# Altium schematic sheet Connectors.SchDoc
size A4
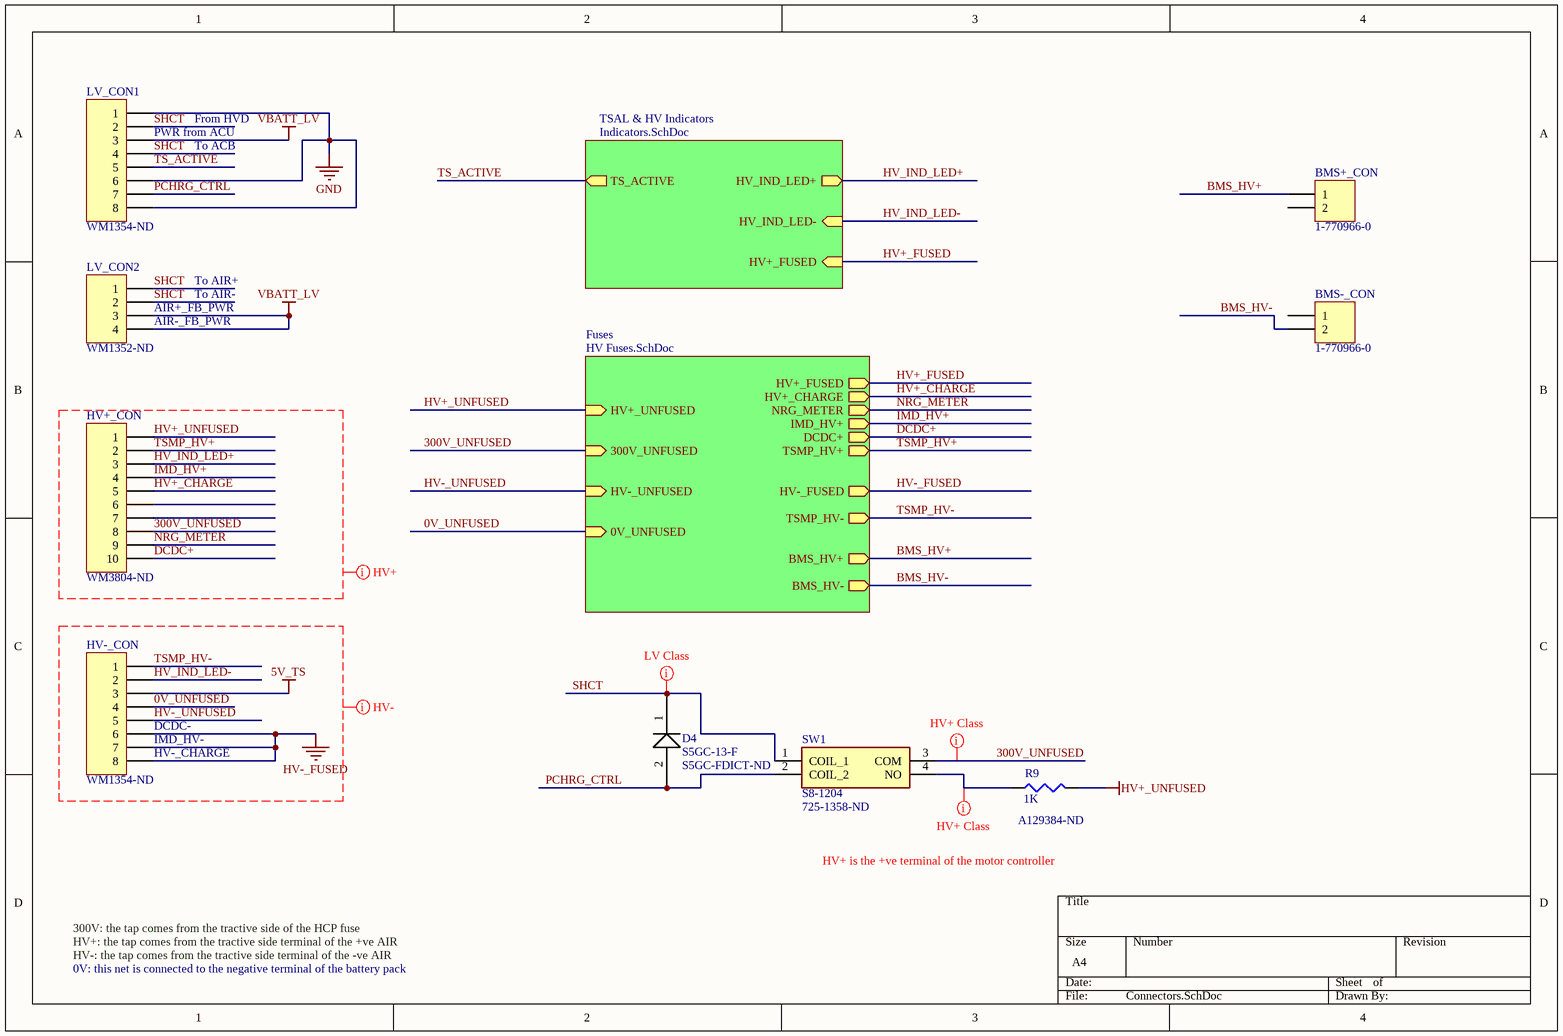
[diagram p0: Connectors.SchDoc]

## Parts
BMS+_CON  1-770966-0  [TE  1-770966-0 2POS CONN]
BMS-_CON  1-770966-0  [TE  1-770966-0 2POS CONN]
D4  S5GC-13-F  Supplier Part Number 1: S5GC-FDICT-ND  [DO-214AB]
HV+_CON  (no value)  [WM3804-ND]
HV-_CON  Supplier Part Number 1: WM1354-ND  [WM3846-ND]  (hidden comment: Header 8)
LV_CON1  Supplier Part Number 1: WM1354-ND  [WM3846-ND]  (hidden comment: Header 8)
LV_CON2  Supplier Part Number 1: WM1352-ND  [WM3801-ND]  (hidden comment: Header 4)
R9  1K  Supplier Part Number 1: A129384-ND  [AXIAL RESISTOR WW 14W]
SW1  S8-1204  Supplier Part Number 1: 725-1358-ND  [S80504VU]

## Sub-sheets
Fuses = HV Fuses.SchDoc: HV+_UNFUSED (in), 300V_UNFUSED (in), HV+_CHARGE (out), NRG_METER (out), IMD_HV+ (out), BMS_HV+ (out), BMS_HV- (out), HV-_UNFUSED (in), 0V_UNFUSED (in), HV+_FUSED (out), DCDC+ (out), TSMP_HV+ (out), HV-_FUSED (out), TSMP_HV- (out)
TSAL & HV Indicators = Indicators.SchDoc: HV_IND_LED+ (out), TS_ACTIVE (out), HV_IND_LED- (in), HV+_FUSED (in)

## Nets
5V_TS: HV-_CON.3
GND: LV_CON1.1 LV_CON1.6 LV_CON1.8
HV+_UNFUSED: HV+_CON.1 R9.2 ; sheet Fuses/HV+_UNFUSED
HV-_FUSED: HV-_CON.6 HV-_CON.7 HV-_CON.8 ; sheet Fuses/HV-_FUSED
VBATT_LV: LV_CON1.3 LV_CON2.3 LV_CON2.4
0V_UNFUSED: HV-_CON.4 ; sheet Fuses/0V_UNFUSED
300V_UNFUSED: HV+_CON.8 SW1.3(COM) ; sheet Fuses/300V_UNFUSED
BMS_HV+: BMS+_CON.1 ; sheet Fuses/BMS_HV+
BMS_HV-: BMS-_CON.2 ; sheet Fuses/BMS_HV-
DCDC+: HV+_CON.10 ; sheet Fuses/DCDC+
HV+_CHARGE: HV+_CON.5 ; sheet Fuses/HV+_CHARGE
HV+_FUSED: sheet TSAL & HV Indicators/HV+_FUSED, sheet Fuses/HV+_FUSED
HV-_UNFUSED: HV-_CON.5 ; sheet Fuses/HV-_UNFUSED
HV_IND_LED+: HV+_CON.3 ; sheet TSAL & HV Indicators/HV_IND_LED+
HV_IND_LED-: HV-_CON.2 ; sheet TSAL & HV Indicators/HV_IND_LED-
IMD_HV+: HV+_CON.4 ; sheet Fuses/IMD_HV+
NRG_METER: HV+_CON.9 ; sheet Fuses/NRG_METER
PCHRG_CTRL: D4.2 LV_CON1.7 SW1.2(COIL_2)
SHCT: D4.1 LV_CON1.2 LV_CON1.4 LV_CON2.1 LV_CON2.2 SW1.1(COIL_1)
TS_ACTIVE: LV_CON1.5 ; sheet TSAL & HV Indicators/TS_ACTIVE
TSMP_HV+: HV+_CON.2 ; sheet Fuses/TSMP_HV+
TSMP_HV-: HV-_CON.1 ; sheet Fuses/TSMP_HV-
NetR9_1: R9.1 SW1.4(NO)

Not connected (* = marked no-connect by the designer): BMS+_CON 2; BMS-_CON 1; HV+_CON 6 7

## Layout directives
mark named HV-: 0V_UNFUSED, 5V_TS, HV-_FUSED, HV-_UNFUSED, HV_IND_LED-, TSMP_HV-
mark named HV+: 300V_UNFUSED, DCDC+, HV+_CHARGE, HV+_UNFUSED, HV_IND_LED+, IMD_HV+, NRG_METER, TSMP_HV+
net class HV+ Class: 300V_UNFUSED, NetR9_1
net class LV Class: SHCT

## Notes on the sheet
- (near LV_CON1) PWR from ACU
- From HVD
- To ACB
- (near LV_CON2) AIR+_FB_PWR
- To AIR+
- To AIR-
- (near LV_CON2) AIR-_FB_PWR
- (near HV-_CON) DCDC-
- (near HV-_CON) IMD_HV-
- (near HV-_CON) HV-_CHARGE
- HV+ is the +ve terminal of the motor controller
- 300V: the tap comes from the tractive side of the HCP fuse
- HV+: the tap comes from the tractive side terminal of the +ve AIR
- HV-: the tap comes from the tractive side terminal of the -ve AIR
- 0V: this net is connected to the negative terminal of the battery pack

## Library data of the parts
BMS+_CON BMS-_CON = Header 2: Header, 2-Pin; LatestRevisionDate: 17-Jul-2002; LatestRevisionNote: Re-released for DXP Platform.; Publisher: Altium Limited
D4 = DIODE 1N4001: DIODE GEN PURP 400V 5A SMC; Supplier 1: Digi-Key
HV+_CON = Header 10: WM3804-ND; LatestRevisionDate: 17-Jul-2002; LatestRevisionNote: Re-released for DXP Platform.; Publisher: Altium Limited; Supplier 1: Digi-Key; Supplier Part Number 1: WM3804-ND
HV-_CON LV_CON1 = Header 8: Header, 8-Pin; LatestRevisionDate: 17-Jul-2002; LatestRevisionNote: Re-released for DXP Platform.; Publisher: Altium Limited; Supplier 1: Digi-Key
LV_CON2 = Header 4: Header, 4-Pin; LatestRevisionDate: 17-Jul-2002; LatestRevisionNote: Re-released for DXP Platform.; Publisher: Altium Limited; Supplier 1: Digi-Key
R9 = Res3: 20J1K0E: RES 1K OHM 10W 5% AXIAL; Published: 8-Jun-2000; LatestRevisionDate: 29-May-2009; LatestRevisionNote: IPC-7351 Footprint Added.; PackageReference: J1-0603; Publisher: Altium Limited; PackageDescription: Chip Resistor; Supplier 1: Digi-Key
SW1 = S8-1204V_RS: Relay or Contactor; Manufacturer_Name: Cynergy3; Manufacturer_Part_Number: S8-1204V/RS; Datasheet Link: http://uk.rs-online.com/web/p/products/1245064; Height: 12mm; RS Part Number: 1245064; RS Price/Stock: http://uk.rs-online.com/web/p/products/1245064; Supplier 1: Digi-Key